# EAGLE design powerboard redux (EAGLE 8.6.1)
COMPANY: ADAFRUIT INDUSTRIES; DRAWN: KTOWN; REV: A
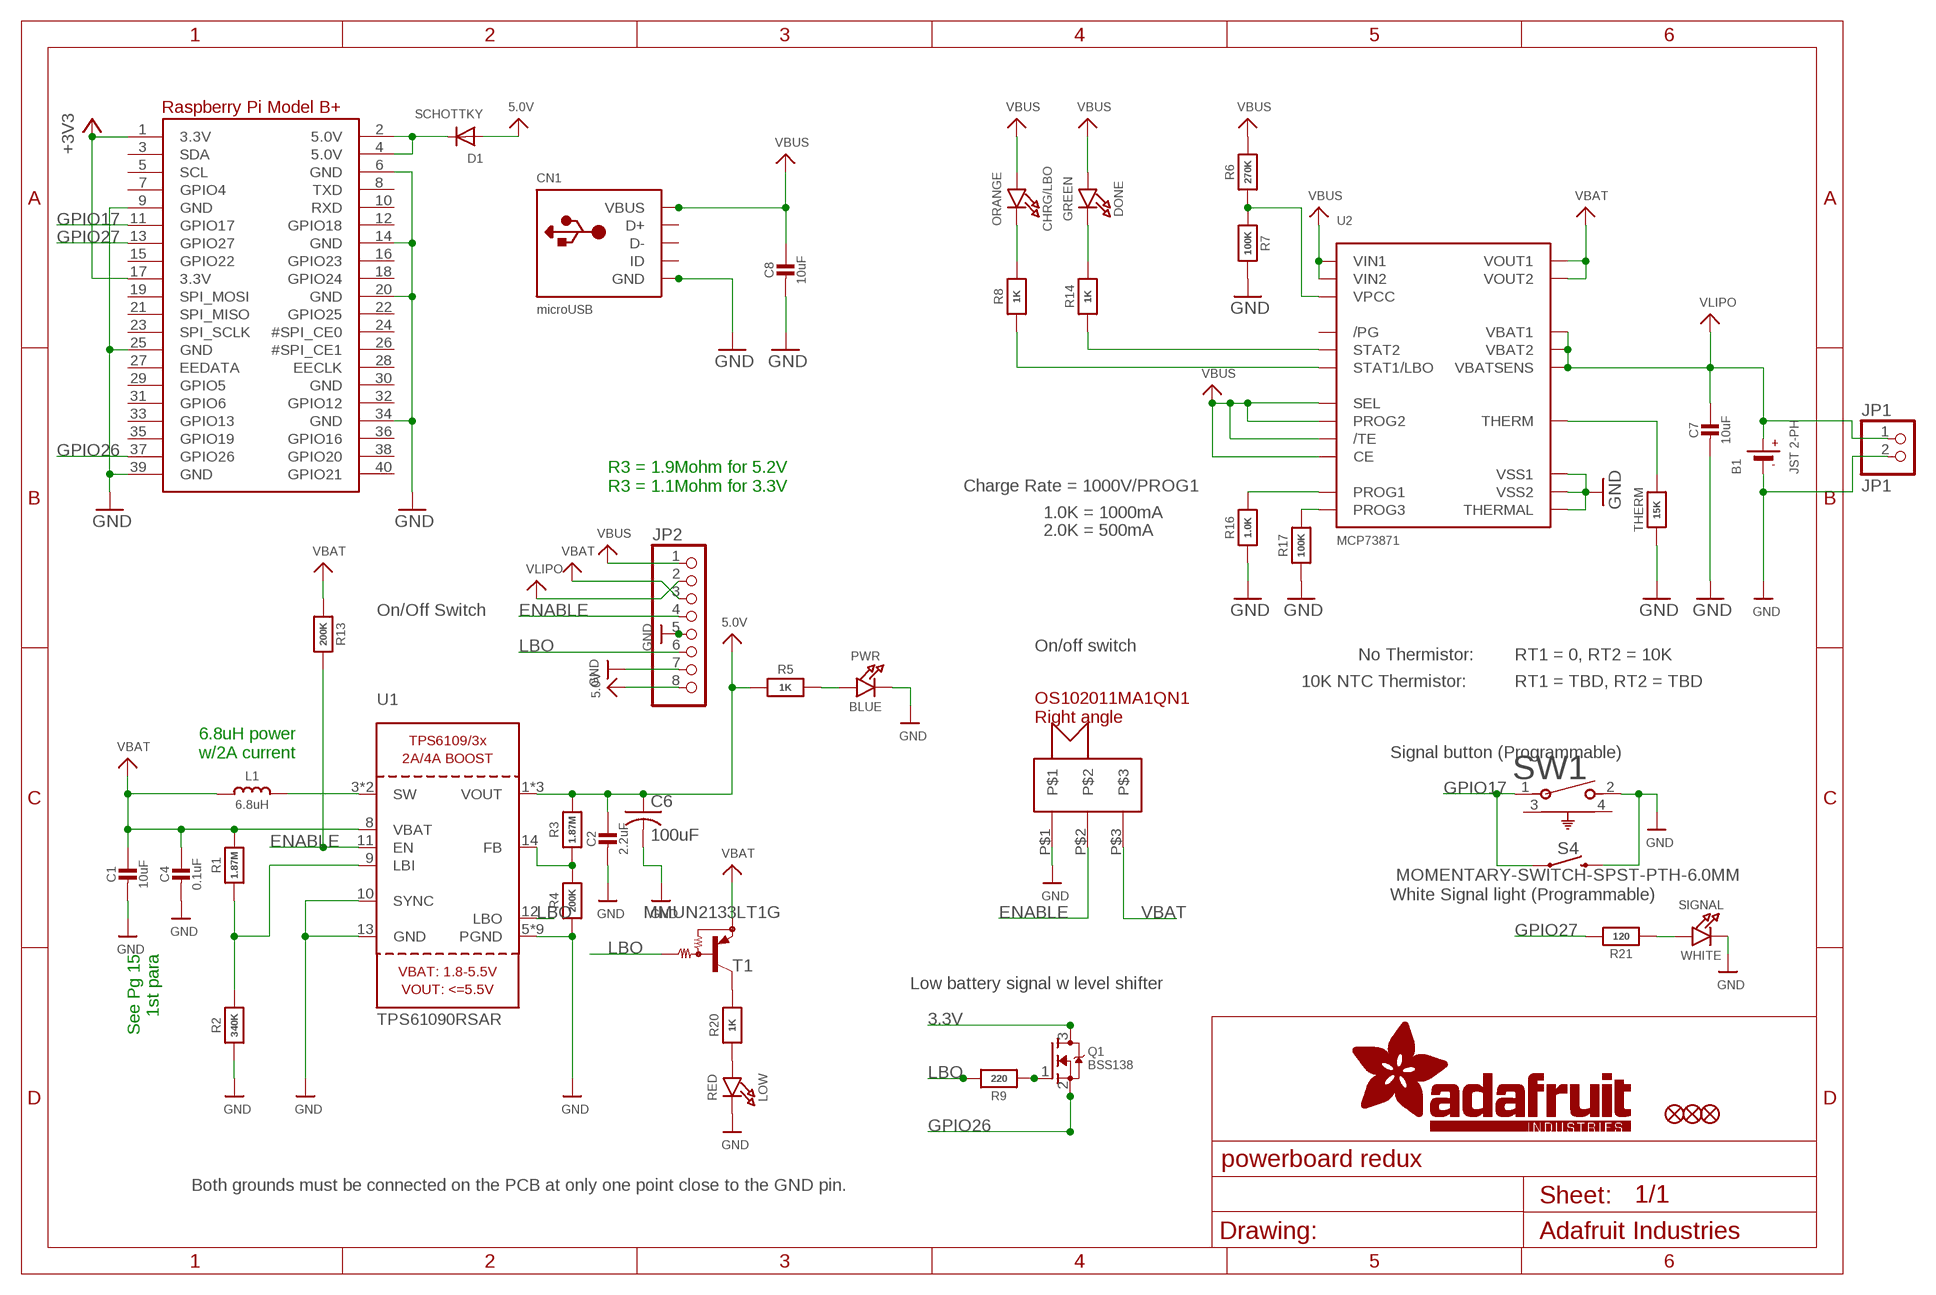
[diagram p0: schematic, sheet 1]

## Parts
B1  JST 2-PH  BATTERY  [JSTPH2]
C1  10uF  CAP_CERAMIC0805-NOOUTLINE  [0805-NO@1]
C2  2.2uF  CAP_CERAMIC0805-NOOUTLINE  [0805-NO@1]
C4  0.1uF  CAP_CERAMIC0805_10MGAP  [0805_10MGAP]
C6  100uF  C-USC1210  [C1210]
C7  10uF  CAP_CERAMIC0805-NOOUTLINE  [0805-NO@1]
C8  10uF  CAP_CERAMIC0805-NOOUTLINE  [0805-NO@1]
CHRG/LBO  ORANGE  LED0805_NOOUTLINE  [CHIPLED_0805_NOOUTLINE]
CN1  microUSB  USBMICRO_20329  [4UCONN_20329]
D1  SCHOTTKY  DIODE_SOD-123FL  [SOD-123FL]
DONE  GREEN  LED0805_NOOUTLINE  [CHIPLED_0805_NOOUTLINE]
FID1  FIDUCIAL""  [FIDUCIAL_1MM]
FID2  FIDUCIAL""  [FIDUCIAL_1MM]
FID3  FIDUCIAL""  [FIDUCIAL_1MM]
JP1  JP1  HEADER-1X2ROUND  [1X02_ROUND]
JP2  HEADER-1X8ROUND  [1X08_ROUND]
L1  6.8uH  INDUCTORTDK_VLC5045  [INDUCTOR_5X5MM_TDK_VLC5045]
LOW  RED  LED0805_NOOUTLINE  [CHIPLED_0805_NOOUTLINE]
PWR  BLUE  LED0805_NOOUTLINE  [CHIPLED_0805_NOOUTLINE]
Q1  BSS138  MOSFET-NREFLOW  [SOT23-R]
R1  1.87M  RESISTOR_0805MP  [_0805MP]
R2  340K  RESISTOR_0805MP  [_0805MP]
R3  1.87M  RESISTOR0805_NOOUTLINE  [0805-NO]
R4  200K  RESISTOR0805_NOOUTLINE  [0805-NO]
R5  1K  RESISTOR0805_NOOUTLINE  [0805-NO]
R6  270K  RESISTOR0805_NOOUTLINE  [0805-NO]
R7  100K  RESISTOR0805_NOOUTLINE  [0805-NO]
R8  1K  RESISTOR0805_NOOUTLINE  [0805-NO]
R9  220  RESISTOR0805_NOOUTLINE  [0805-NO]
R13  200K  RESISTOR0805_NOOUTLINE  [0805-NO]
R14  1K  RESISTOR0805_NOOUTLINE  [0805-NO]
R16  1.0K  RESISTOR0805_NOOUTLINE  [0805-NO]
R17  100K  RESISTOR0805_NOOUTLINE  [0805-NO]
R20  1K  RESISTOR0805_NOOUTLINE  [0805-NO]
R21  120  RESISTOR0805_NOOUTLINE  [0805-NO]
RPI1  RASPBERRYPI_BPLUS_BONNETNODIM  [PI_BONNET_NODIM]
S4  MOMENTARY-SWITCH-SPST-PTH-6.0MM  [TACTILE_SWITCH_PTH_6.0MM]
SIGNAL  WHITE  LED0805_NOOUTLINE  [CHIPLED_0805_NOOUTLINE]
SW1  1825027-5  [SW2_1825027-A]
SW2  OS102011MA1QN1  [OS102011MA1QN1]
T1  MMUN2133LT1G  MUN2114T1-PNP_DRIVER-SC59-BEC  [SC59-BEC]
THERM  15K  RESISTOR0805_NOOUTLINE  [0805-NO]
U1  TPS61090RSAR  VREG_TPS6103X  [PVQFN-16]
U2  MCP73871  [QFN20_4MM]

## Nets
3.3V: Q1.3(D) RPI1.1(3.3V) RPI1.17(3.3V) ; supply symbol labelled +3V3
5.0V: C2.1 C6.1 D1.A JP2.8 R3.2 R5.1 U1.1(VOUT) U1.15(VOUT) U1.16(VOUT)
5.0V@1: D1.C RPI1.2(5.0V) RPI1.4(5.0V)
ENABLE: JP2.4 R13.2 SW2.P$2 U1.11(EN)
GND: B1.1(-) C1.2 C2.2 C4.2 C6.2 C7.2 C8.2 CN1.BASE@1(GND) CN1.BASE@2(GND) CN1.GND CN1.SPRT@1(GND) CN1.SPRT@2(GND) CN1.SPRT@3(GND) CN1.SPRT@4(GND) JP1.2 JP2.5 JP2.7 LOW.C PWR.C R2.1 R4.1 R7.2 R16.1 R17.1 RPI1.6(GND) RPI1.9(GND) RPI1.14(GND) RPI1.20(GND) RPI1.25(GND) RPI1.34(GND) RPI1.39(GND) S4.3 SIGNAL.C SW1.2 SW2.P$1 THERM.1 U1.5(PGND) U1.6(PGND) U1.7(PGND) U1.10(SYNC) U1.13(GND) U1.P$18(PGND) U1.P$19(PGND) U1.P$20(PGND) U1.P$21(PGND) U1.P$22(PGND) U1.THERMAL(PGND) U2.P$10(VSS1) U2.P$11(VSS2) U2.P$21(THERMAL)
GPIO17: RPI1.11(GPIO17) S4.1 SW1.1
GPIO26: Q1.2(S) RPI1.37(GPIO26)
GPIO27: R21.2 RPI1.13(GPIO27)
LBO: JP2.6 R9.2 T1.B U1.12(LBO)
N$1: L1.P$2 U1.3(SW) U1.4(SW)
N$2: LOW.A R20.1
N$3: R1.1 R2.2 U1.9(LBI)
N$4: PWR.A R5.2
N$5: R3.1 R4.2 U1.14(FB)
N$6: R20.2 T1.C
N$7: R6.1 R7.1 U2.P$2(VPCC)
N$8: DONE.C R14.2
N$9: R14.1 U2.P$7(STAT2)
N$10: THERM.2 U2.P$5(THERM)
N$11: R8.1 U2.P$8(STAT1/LBO)
N$12: CHRG/LBO.C R8.2
N$13: R17.2 U2.P$12(PROG3)
N$14: Q1.1(G) R9.1
N$15: R21.1 SIGNAL.A
N$16: R16.2 U2.P$13(PROG1)
VBAT: C1.1 C4.1 JP2.3 L1.P$1 R1.2 R13.1 SW2.P$3 T1.E U1.8(VBAT) U2.P$1(VOUT1) U2.P$20(VOUT2)
VBUS: C8.1 CHRG/LBO.A CN1.VBUS DONE.A JP2.1 R6.2 U2.P$3(SEL) U2.P$4(PROG2) U2.P$9(/TE) U2.P$17(CE) U2.P$18(VIN1) U2.P$19(VIN2)
VLIPO: B1.2(+) C7.1 JP1.1 JP2.2 U2.P$14(VBAT1) U2.P$15(VBAT2) U2.P$16(VBATSENS)
Unconnected: CN1.D+ CN1.D- CN1.ID RPI1.3(SDA) RPI1.5(SCL) RPI1.7(GPIO4) RPI1.8(TXD) RPI1.10(RXD) RPI1.12(GPIO18) RPI1.15(GPIO22) RPI1.16(GPIO23) RPI1.18(GPIO24) RPI1.19(SPI_MOSI) RPI1.21(SPI_MISO) RPI1.22(GPIO25) RPI1.23(SPI_SCLK) RPI1.24(#SPI_CE0) RPI1.26(#SPI_CE1) RPI1.27(EEDATA) RPI1.28(EECLK) RPI1.29(GPIO5) RPI1.31(GPIO6) RPI1.32(GPIO12) RPI1.33(GPIO13) RPI1.35(GPIO19) RPI1.36(GPIO16) RPI1.38(GPIO20) RPI1.40(GPIO21) SW1.3 SW1.4 U2.P$6(/PG)

## Notes on the sheet
- R3 = 1.9Mohm for 5.2V
  R3 = 1.1Mohm for 3.3V
- Charge Rate = 1000V/PROG1
- 1.0K = 1000mA
- 2.0K = 500mA
- On/Off Switch
- On/off switch
- No Thermistor: | RT1 = 0, RT2 = 10K
- 10K NTC Thermistor: | RT1 = TBD, RT2 = TBD
- 6.8uH power
  w/2A current
- Signal button (Programmable)
- White Signal light (Programmable)
- See Pg 15
  1st para
- Low battery signal w level shifter
- Both grounds must be connected on the PCB at only one point close to the GND pin.

## Power pins joined to a net without a drawn wire
GND: RPI1.30(GND)

## Library data of the parts
B1 = microbuilder:BATTERY: CR1220 SMT - Digikey: 3001K-ND CD2032 BAT-HLD-001 - Digikey: BAT-HLD-001-ND
C1 C2 C4 C7 C8 = microbuilder:CAP_CERAMIC: Ceramic Capacitors For new designs, use the packages preceded by an '_' character since they are more reliable: The following footprints should be used on most boards: _0402 - Standard footprint for regular board layouts _0603 - Standard footprint for regular board layouts _0805 - Standard footprint for regular board layouts _1206 - Standard footprint for regular board layouts For extremely tight-pitch boards where space is at a premium, the following 'micro-pitch' footprints can be used (smaller pads, no silkscreen outline, etc.): _0402MP - Micro-pitch footprint for very dense/compact boards _0603MP - Micro-pitch footprint for very dense/compact boards _0805MP - Micro-pitch footprint for very dense/compact boards _1206MP - Micro-pitch footprint for very dense/compact boards
C6 = rcl:C-US: CAPACITOR, American symbol
CHRG/LBO DONE LOW PWR SIGNAL = microbuilder:LED: LED 0603 - 0603 Surface Mount Package 2mA: Green LED - Low Power (3.9mcd, 2ma, 1.7Vf) - Digikey: 475-2709-2-ND Orange LED - Low Power (9.8mcd, 2ma, 1.8Vf) - Digikey: 475-1194-2-ND Red LED - Low Power (5mcd, 2ma, 1.8Vf) - Digikey: 475-1195-2-ND Yellow LED - Low Power (7mcd, 2ma, 1.8Vf) - Digikey: 475-1196-2-ND 5mA: Blue LED - Low Power (17mcd, 5ma, 2.9Vf) - Digikey: LNJ937W8CRACT-ND 0805 - 0805 Surface Mount Package 2mA: Red LED (8.8mcd, 2mA, 1.8Vf, Clear) - Low Power [Digikey: 475-2510-1-ND] Green LED (5mcd, 2mA, 1.8Vf, Clear) - Low Power [Digikey: 475-2730-1-ND] Yellow LED (11.3mcd, 2mA, 1.8Vf, Clear) - Low Power [Digikey: 475-2555-1-ND] 20mA: Red LED (104mcd, 20mA, Diffused) - LS R976 [Digikey: 475-1278-6-ND] Red LED (12mcd, 20mA, 2.0Vf, Clear) - APT2012EC [Digikey: 754-1128-1-ND] Green LED (15mcd, 20mA, 2.2Vf, Clear) - APT2012GC [Digikey: 754-1131-1-ND] Orange LED (160mcd, 20mA, 2.1Vf, Clear) - APT2012SECK [Digikey: 754-1130-1-ND] 1206 - 1206 Surface Mount Package Green LED (26mcd, 20mA, Diffused) - LG N971 [Digikey: 475-1407-6-ND] Red LED (15mcd, 20mA, Diffused) - LH N974 [Digikey: 475-1416-6-ND] Cree - Cree High-Power Surface Mount LEDs XPEBWT-L1-0000-00D50 - White 111lm 350mA 2.9Vf 6200K 110° XTEAWT-00-0000-00000LEE3 - White 114lm 350mA 2.85Vf 5000K 115° Everlight - Everlight 45-21 Series Surface Mount LEDs 45-21/QK2C-B2832AC2CB2/2T - Warm White 2000mcd 20mA 3.25Vf 3050K 120° 45-21/LK2C-B38452C4CB2/2T - Nuetral White 2000mcd 20mA 3.25Vf 4150K 120° 45-21/LK2C-B50634C6CB2/2T - Cold White 2200mcd 20mA 3.25Vf 5650K 120° PLCC2 Reverse Mount LS T77K-J1L2-1-0-2-R18-Z - Red 11.25mcd 2mA 1.8Vf 630nm 120° LO T77K-L1M2-24-Z - Orange 19.6mcd 2mA 1.8Vf 606nm 120° LY T77K-K2M1-26-Z - Yellow 15.7mcd 2mA 1.8Vf 587nm 120°
CN1 = microusb-amphenol-10118194-0001LF:USB: USB Connectors USBMINIB - Surface Mount Female Mini-B USB Connector 4UConnector: 06564
D1 = adafruit:DIODE: Diode SMADIODE - SMA Surface Mount Package 20V 1A Schottky Diode Digikey: 641-1014-6-ND DO-1N4148 - Through Hole Small Current Diode SOD-123 20V 1 A (.5mV Vf) Schottky Diode - Digikey: MBRX120TPMSCT-ND SOD-323 10V 570mA (.38mV Vf, 3ns) Schottky Diode - Digikey: ZLLS410CT-ND SOD-523 30V 30mA Schottky Diode (RB751S-40TE61) - Digikey: RB751S-40TE61CT-ND SOT23-R/W - SOT23 Package (R = Solder Paste/Reflow Ovens, W = Hand-Soldering) BAT54Film 40V 300mA - Digikey: 497-7162-1-ND
FID1-FID3 = microbuilder:FIDUCIAL: Fiducial Alignment Points Various fiducial points for machine vision alignment.; BOM: EXCLUDE
JP1 = microbuilder:HEADER-1X2: PIN HEADER
JP2 = microbuilder:HEADER-1X8: PIN HEADER
L1 = microbuilder:INDUCTOR: Inductors 0603: 10nH Ceramic Inductor - microwire antenna/RF (Digikey: 712-1434-2-ND) 0805: 560nH Ceramic Inductor - RF (Digikey: 553-1047-1-ND) 270nH Ceramic Inductor - Q = 40@250MHz, +-5%, 1 Ohm DC Resistance (Digikey: 535-10506-2-ND) 1007 (2518 Metric) SMT: 10µH 10% 250mOhm 820mA 1007 Inductor (Digikey: 587-2189-1-ND) 22µH 10% 500mOhm 580mA 1007 Inductor (Digikey: 587-2190-1-ND) 47µH 10% 950mOhm 420mA 1007 Inductor (Digikey: 587-2191-1-ND) 47µH 5% 100mOhm 1A 1008 Inductor (Digikey: 732-1816-1-ND) 5.0x5.0mm (Taiyo Yuden NR5040 Series) 6.8µH 20% 2.3A 64mOhm Inductor (Digikey: 587-2374-2-ND) 5.0x5.0mm (TDK VLC5045 Series) 4.7µH 20% 3.3A 34mOhm Inductor (Digikey: 445-6526-1-ND) 6.8µH 20% 2.7A 46mOhm Inductor (Digikey: 445-6527-1-ND) 6.0x6.0mm (TDK VLC6045 Series) 4.7µH 20% 3.8A 27mOhm Inductor (Digikey: 445-6538-2-ND) 6.8µH 20% 3A 41mOhm Inductor (Digikey: 445-6540-1-ND) 6.2µH 30% 2.2A 45mOhm Inductor (Digikey: SRR5028-6R2YCT-ND) - Not TDK VLC6045 but footprint should match 6.0x6.0mm (TDK SLF6045 Series) 6.8uH 30% 2A 33mOhm Inductor (Digikey: 445-4572-1-ND, Mouser: 810-SLF645T6R8N2R0PF) 6.0x6.0mm (Sumida CDRH5D28 Series) 6.2uH 30% 1.8A 45mOhm Inductor (Digikey: 308-1542-1-ND) Taiyo Yuden NR3015T2R2M - 2.2uH 20% 1.5A (Digikey: 587-1648-2-ND, Mouser: 963-NR3015T2R2M) - Used with TI TPS62172 CoilCraft RFID Transponder Coil - MA5532-AE (For use with AS3935 Lightning Sensor) Vishay IHLP 1.0uH Molded Inductor - 24mOhm DCR, 5A, +/-20%, -55°C-125°C (Digikey: 541-1319-1-ND)
Q1 = microbuilder:MOSFET-N: N-Channel Mosfet LEGEND VDS: Voltage Drain-Source ID: Drain Current RDS(ON): Drain-Source On-State Resistance VGS(TH): Gate-Source Threshold Voltage CISS: Drain-Source Input Capacitance SOT-23 Name VDS ID RDS(ON) VGS(TH) CISS Order Number 2N7002E 60V 260mA 2.5 Ohm 2.5V @ 250uA 26.7pF @ 25V 2N7002ET1GOSTR-ND BSH103 30V 850mA 400 mOhm 400mV @ 1mA 83pF @ 24V BSH103,235-ND BSS138 60V 320mA 1.6 Ohm 1.5V @ 250uA 50pF @ 10V Mouser: 771-BSS138PW115 DMN2075U-7 20V 4.2A 38 mOhm 1V @ 250 uA 594.3pF @ 10V DMN2075U-7DICT-ND * BSS138 good choice for I2C level-shifting
R1-R9 R13 R14 R16 R17 R20 R21 THERM = microbuilder:RESISTOR: Resistors For new designs, use the packages preceded by an '_' character since they are more reliable: The following footprints should be used on most boards: _0402 - Standard footprint for regular board layouts _0603 - Standard footprint for regular board layouts _0805 - Standard footprint for regular board layouts _1206 - Standard footprint for regular board layouts For extremely tight-pitch boards where space is at a premium, the following 'micro-pitch' footprints can be used (smaller pads, no silkscreen outline, etc.): _0402MP - Micro-pitch footprint for very dense/compact boards _0603MP - Micro-pitch footprint for very dense/compact boards _0805MP - Micro-pitch footprint for very dense/compact boards _1206MP - Micro-pitch footprint for very dense/compact boards
RPI1 = microbuilder:RASPBERRYPI_BPLUS
S4 = SparkFun-Switches:MOMENTARY-SWITCH-SPST: Momentary Switch (Pushbutton) - SPST Normally-open (NO) SPST momentary switches (buttons, pushbuttons). Variants PTH-12MM - 12mm square, through-hole Momentary Pushbutton Switch - 12mm Square <https://www.sparkfun.com/products/9190> (COM-09190) PTH-6.0MM, PTH-6.0MM-KIT - 6.0mm square, through-hole Mini Pushbutton Switch <https://www.sparkfun.com/products/97> (COM-00097) KIT package intended for soldering kit's - only one side of pads' copper is exposed. PTH-RIGHT-ANGLE-KIT - Right-angle, through-hole Right Angle Tactile Button <https://www.sparkfun.com/products/10791> - Used on SparkFun BigTime Watch Kit <https://www.sparkfun.com/products/11734> SMD-12MM - 12mm square, surface-mount Tactile Button - SMD (12mm) <https://www.sparkfun.com/products/12993> (COM-12993) Used on SparkFun PicoBoard <https://www.sparkfun.com/products/11888> SMD-4.5MM - 4.5mm Square Trackball Switch Used on SparkFun Blackberry Trackballer Breakout <https://www.sparkfun.com/products/13169> SMD-4.6MMX2.8MM - 4.60mm x 2.80mm, surface mount Used on SparkFun SAMD21 Mini Breakout <https://www.sparkfun.com/products/13664> SMD-5.2MM, SMD-5.2-REDUNDANT - 5.2mm square, surface-mount Mini Pushbutton Switch - SMD <https://www.sparkfun.com/products/8720> (COM-08720) Used on Arduino Pro Mini <https://www.sparkfun.com/products/11114> REDUNDANT package connects both switch circuits together SMD-6.0X3.5MM - 6.0 x 3.5mm, surface mount Momentary Reset Switch SMD <https://www.sparkfun.com/products/8229> (COM-08229) SMD-6.2MM-TALL - 6.2mm square, surface mount Tactile Button - SMD (6mm) <https://www.sparkfun.com/products/12992> Used on SparkFun Digital Sandbox <https://www.sparkfun.com/products/12651> SMD-RIGHT-ANGLE - Right-angle, surface mount Used on SparkFun Block for Intel® Edison - Arduino <https://www.sparkfun.com/products/13036>; PROD_ID: SWCH-08441; SF_SKU: COM-00097
SW1 = right angle tactile switch 1825027-5 te connect:1825027-5: Digi-Key part <https://www.digikey.com/product-detail/en/te-connectivity-alcoswitch-switches/1825027-5/450-1662-ND/529484>; MANUFACTURER_PART_NUMBER: 18250275; VENDOR: TE Connectivity
SW2 = rightangleslideswitchspdt:OS102011MA1QN1: OS102011MA1QN1 right angle SPDT slide switch from C&K Vendor Specs <https://www.ckswitches.com/media/1428/os.pdf> Digikey part <https://www.digikey.com/product-detail/en/c-k/OS102011MA1QN1/CKN9559-ND/1981430>
T1 = transistor:*-PNP_DRIVER-: PNP Bias Resistor Transistor
U1 = microbuilder:VREG_TPS6103X: TPS6103x 4A Boost - 1.8-5.5V Input, Adjustable Output to 5.5V
U2 = microbuilder:MCP73871: MCP73871 Lithium Polymer Battery Charger Digikey: MCP73871-2CCI/ML-ND

## Board
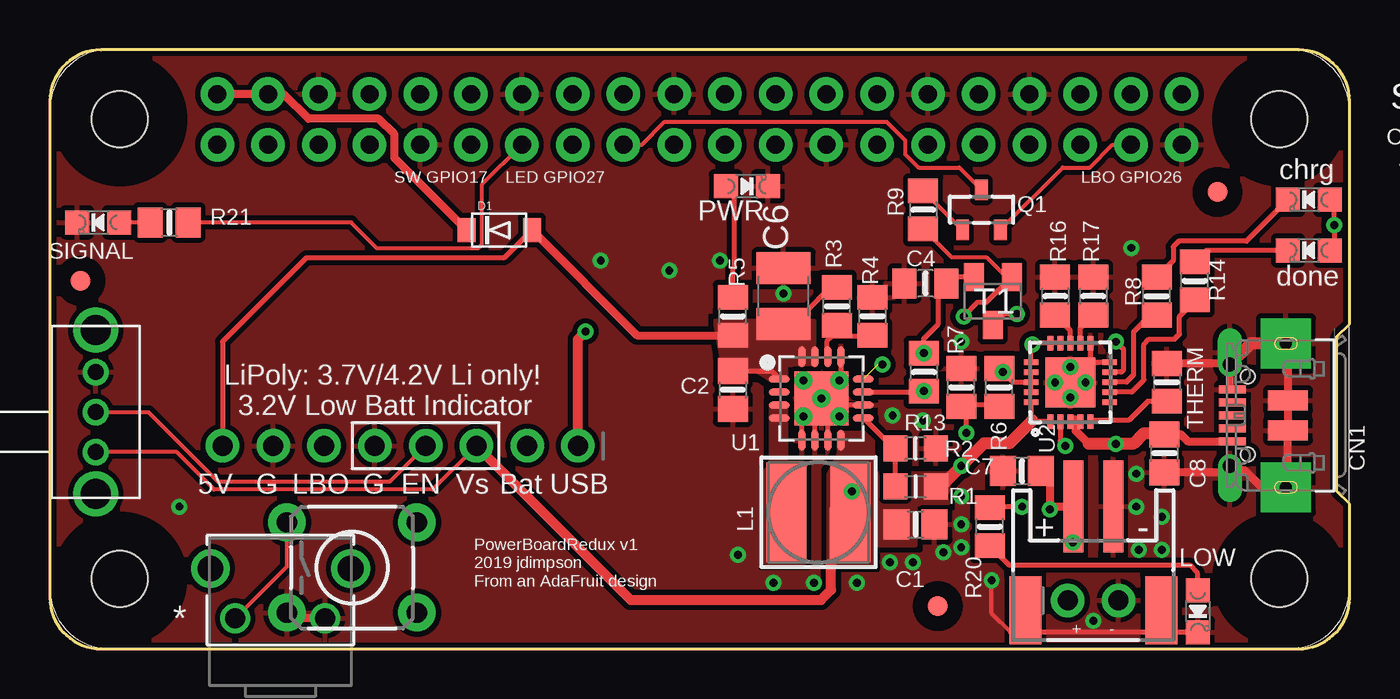
[diagram p1: board, top side]
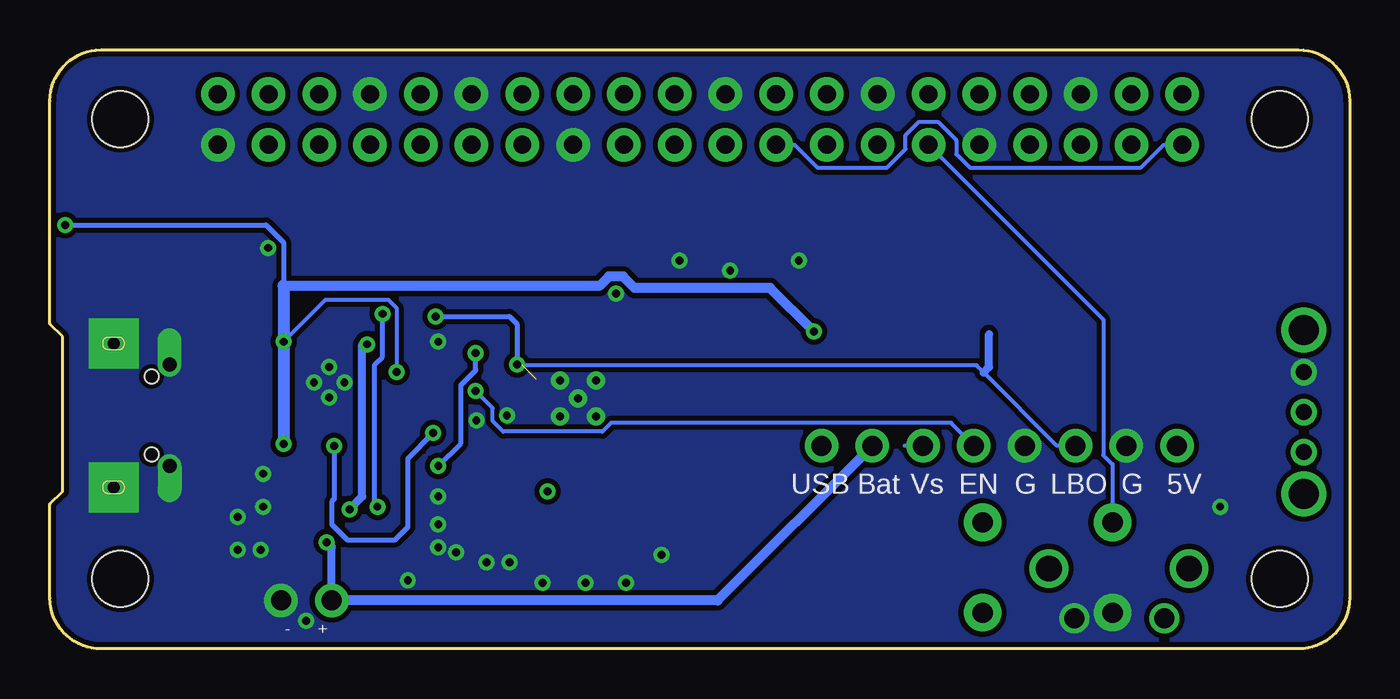
[diagram p2: board, bottom side, seen from below]

Size 65.02 x 29.97 mm. Coordinates in mm from the lower left corner, seen from the top.
Outline: 0,27.43 0,2.54 arc90 2.54,0 62.48,0 arc90 65.02,2.54 65.02,7.24 64.39,7.87 64.39,15.62 65.02,16.26 65.02,27.43 arc90 62.48,29.97 2.54,29.97 arc90 0,27.43
Copper layers (1*16): Top 0.035mm / dielectric 1.5mm / Bottom 0.035mm
Design rules "adafruit *": minimum track width 8mil, minimum drill 15.5mil, track to track 8mil, track to pad 8mil, pad to pad 8mil, via to via 8mil, smd to smd 8mil, copper to edge 10mil, drill to drill 8mil, minimum pad ring 10mil, minimum via ring 8mil, stop-mask expansion 2mil, vias tented up to drill 20mil, thermal gap 10mil
tRestrict: area 39.8,14.4 to 39.9,14.8; area 37.8,10.3 to 38,10.7; area 38.5,10.3 to 38.6,10.7

### Footprints (pad centres in the part's own frame; a part is rotated, then mirrored left to right if it is on the bottom)
JSTPH2 = smd 1 x 4.6: 1 -1,-3.7; 2 1,-3.7 | smd 1.6 x 3.4: NC1 -3.4,1.5; NC2 3.4,1.5
0805-NO@1 = smd 1.3 x 1.5: 1 -0.95,0; 2 0.95,0
0805_10MGAP = smd 1.2 x 1.5: 1 -1.05,0; 2 1.05,0
C1210 = smd 1.6 x 2.7: 1 -1.4,0; 2 1.4,0
CHIPLED_0805_NOOUTLINE = smd 1.2 x 1.2: A 0,-1.05; C 0,1.05
4UCONN_20329 = smd 1 x 2: BASE@1 -0.75,-2; BASE@2 0.75,-2 | smd 0.4 x 1.35: D+ 0,0.775; D- -0.65,0.775; GND 1.3,0.775; ID 0.65,0.775; VBUS -1.3,0.775 | drill 0.7 offset: SPRT@1 -2.538,0.9; SPRT@2 2.538,0.9 | drill 0.6 pad 2.5 square: SPRT@3 -3.6,-1.9; SPRT@4 3.6,-1.9 | hole 0.7: -1.95,0; 1.95,0
SOD-123FL = smd 0.91 x 1.22: A 1.637,0; C -1.637,0
FIDUCIAL_1MM = smd 1 x 1: 1 0,0
1X02_ROUND = drill 1 pad 1.676: 1 -1.27,0; 2 1.27,0
1X08_ROUND = drill 1 pad 1.676: 1 -8.89,0; 2 -6.35,0; 3 -3.81,0; 4 -1.27,0; 5 1.27,0; 6 3.81,0; 7 6.35,0; 8 8.89,0
INDUCTOR_5X5MM_TDK_VLC5045 = smd 2 x 5: P$1 -1.6,0; P$2 1.6,0
SOT23-R = smd 0.635 x 1.016: 1 -0.95,-1; 2 0.95,-1; 3 0,1
_0805MP = smd 1.2 x 1.3: 1 -1.016,0; 2 1.016,0
0805-NO = smd 1.24 x 1.5: 1 -0.95,0; 2 0.95,0
PI_BONNET_NODIM = drill 0.9 pad 1.676: 1 8.37,25.23; 2 8.37,27.77; 3 10.91,25.23; 4 10.91,27.77; 5 13.45,25.23; 6 13.45,27.77; 7 15.99,25.23; 8 15.99,27.77; 9 18.53,25.23; 10 18.53,27.77; 11 21.07,25.23; 12 21.07,27.77; 13 23.61,25.23; 14 23.61,27.77; 15 26.15,25.23; 16 26.15,27.77; 17 28.69,25.23; 18 28.69,27.77; 19 31.23,25.23; 20 31.23,27.77; 21 33.77,25.23; 22 33.77,27.77; 23 36.31,25.23; 24 36.31,27.77; 25 38.85,25.23; 26 38.85,27.77; 27 41.39,25.23; 28 41.39,27.77; 29 43.93,25.23; 30 43.93,27.77; 31 46.47,25.23; 32 46.47,27.77; 33 49.01,25.23; 34 49.01,27.77; 35 51.55,25.23; 36 51.55,27.77; 37 54.09,25.23; 38 54.09,27.77; 39 56.63,25.23; 40 56.63,27.77 | hole 2.8: 3.5,3.5; 3.5,26.5; 61.5,26.5; 61.5,3.5
TACTILE_SWITCH_PTH_6.0MM = drill 1.016 pad 1.88: 1 -3.251,2.261; 2 3.251,2.261; 3 -3.251,-2.261; 4 3.251,-2.261
SW2_1825027-A = drill 0.991 pad 1.499: 1 0,0; 2 4.496,0 | drill 1.295 pad 1.803: 3 -1.245,2.489; 4 5.766,2.489
OS102011MA1QN1 = drill 0.8: P$1 0,0; P$2 2,0; P$3 4,0 | drill 1.5: P$4 -2.1,0; P$5 6.1,0
SC59-BEC = smd 1 x 1.4: B -0.95,-1.2; C 0,1.2; E 0.95,-1.2
PVQFN-16 = smd 1.05 x 0.35: 1 -2.1,0.975; 2 -2.1,0.325; 3 -2.1,-0.325; 4 -2.1,-0.975; 9 2.1,-0.975; 10 2.1,-0.325; 11 2.1,0.325; 12 2.1,0.975 | smd 0.35 x 1.05: 5 -0.975,-2.1; 6 -0.325,-2.1; 7 0.325,-2.1; 8 0.975,-2.1; 13 0.975,2.1; 14 0.325,2.1; 15 -0.325,2.1; 16 -0.975,2.1 | drill 0.4: P$18 0,0; P$19 -0.9,0.9; P$20 0.9,0.9; P$21 0.9,-0.9; P$22 -0.9,-0.9 | smd 2.7 x 2.7: THERMAL 0,0
QFN20_4MM = smd 0.73 x 0.28: P$1 -1.965,1; P$2 -1.965,0.5; P$3 -1.965,0; P$4 -1.965,-0.5; P$5 -1.965,-1; P$11 1.965,-1; P$12 1.965,-0.5; P$13 1.965,0; P$14 1.965,0.5; P$15 1.965,1 | smd 0.28 x 0.73: P$6 -1,-1.965; P$7 -0.5,-1.965; P$8 0,-1.965; P$9 0.5,-1.965; P$10 1,-1.965; P$16 1,1.965; P$17 0.5,1.965; P$18 0,1.965; P$19 -0.5,1.965; P$20 -1,1.965 | smd 2.5 x 2.5: P$21 0,0

### Placement (x,y rotation side)
B1  52.2,3.43 180 top
C1  43.31,6.22 0 top
C2  34.16,12.95 270 top
C4  43.81,18.29 180 top
C6  36.7,17.65 90 top
C7  48.64,8.89 180 top
C8  55.75,9.78 270 top
CHRG/LBO  62.99,22.48 90 top
CN1  59.94,11.68 90 top
D1  22.48,20.96 0 top
DONE  62.99,19.94 90 top
FID1  1.52,18.41 180 top
FID2  44.43,2.14 270 top
FID3  58.42,22.86 180 top
JP1  52.2,2.41 0 top
JP2  17.53,10.16 180 top
L1  38.46,6.83 180 top
LOW  57.44,1.87 180 top
PWR  34.87,23.15 270 top
Q1  46.61,21.97 0 top
R1  43.31,8.13 0 top
R2  43.31,10.03 180 top
R3  39.37,17.14 90 top
R4  41.15,16.64 270 top
R5  34.16,16.64 90 top
R6  47.5,13.08 90 top
R7  45.59,13.08 90 top
R8  55.37,17.65 90 top
R9  43.69,21.97 270 top
R13  43.72,13.84 270 top
R14  57.28,18.41 90 top
R16  50.29,17.65 270 top
R17  52.2,17.65 270 top
R20  47.02,6.11 90 top
R21  5.97,21.34 0 top
RPI1  0,0 0 top
S4  15.11,4.06 0 top
SIGNAL  2.41,21.34 90 top
SW1  9.27,1.52 0 top
SW2  2.29,13.84 270 top
T1  47.17,17.4 180 top
THERM  55.88,13.34 270 top
U1  38.59,12.53 0 top
U2  51.05,13.34 90 top

### Tracks (layer width: path | path; a pad name or v marks a point on that pad's centre or on a via)
3.3V
  Top 0.203: RPI1.17 29.61,25.23 30.76,26.37 41.86,26.37 42.79,25.45 42.79,24.76 43.46,24.09 45.49,24.09 Q1.3
  Bottom 0.203: RPI1.17 27.77,25.23 26.62,24.09 23.14,24.09 22.21,25.01 22.21,25.7 21.54,26.37 20.6,26.37 19.67,25.45 19.67,24.76 19,24.09 10.44,24.09 9.29,25.23 RPI1.1
5.0V
  Top 0.254: R3.2 39.05,18.09 37.85,16.89 37.34,16.89 C6.1 | C2.1 36.09,13.9 U1.1 | D1.A 22.72,19.56 12.83,19.56 8.64,15.37 JP2.8
  Top 0.406: D1.A 29.38,15.69 R5.1
  pour Top (isolate 0.254, no thermals): 38.23,14.22 38.23,16.38 33.27,16.38 33.66,14.35 34.67,14.35 36.07,13.46 36.83,13.46 36.83,14.22
5.0V@1
  Top 0.406: D1.C 17.23,24.56 17.23,25.75 16.46,26.53 12.93,26.53 11.69,27.77 RPI1.4 RPI1.2
ENABLE  (via drill 0.4)
  Top 0.203: SW2.P$2 4.92,11.84 8.38,8.38 17.02,8.38 JP2.4
  Top 0.254: U1.11 43.68,12.85 R13.2
  Bottom 0.203: JP2.4 19.94,11.3 36.95,11.3 37.38,10.87 42.34,10.87 42.87,11.39 42.87,12.04 R13.2
  other vias: 43.72,12.89
GND  (via drill 0.39)
  Top 0.203: 48.07,0.82 47.12,1.78 v47.12,3.43
  Top 0.254: U1.13 39.57,13.66 39.37,13.46 39.46,13.46 U1.P$20 | U1.10 39.25,12.2 39.24,12.19 39.49,11.94 U1.P$21 39.42,11.56 38.99,11.56 38.92,11.49 U1.7 | U1.6 38.27,11.77 38.1,11.94 | U1.5 37.62,11.55 U1.P$22 | LOW.C 48.07,0.82 | U2.P$11 52.05,13.57 v51.82,13.34 | U2.P$10 51.29,14.34 v51.05,14.1
  Top 0.406: CN1.GND 59.04,13.11 CN1.SPRT@2 58.98,14.29 THERM.1 | CN1.SPRT@4 61.94,15.18 CN1.BASE@2 CN1.BASE@1 61.94,8.18 CN1.SPRT@3 60.62,8.08 59.78,8.93 59.61,8.93 59.39,9.15 CN1.SPRT@1 58.73,8.83 C8.2 | SW1.2 12.14,1.52 S4.3
  Top 0.61: CN1.SPRT@4 60.11,15.28 CN1.SPRT@2
  other vias: 34.42,4.7 36.7,17.78 33.53,19.43 30.99,18.92 27.56,19.43 43.69,11.43 45.59,15.37 51.05,12.57 54.1,20.07 42.16,11.68 50.29,13.34 45.59,7.62 43.18,4.32 42.04,4.32 45.59,6.22 44.7,4.83 45.59,5.08 54.36,7.11 54.36,8.76 54.48,4.95 55.63,4.95 55.63,6.6 36.2,3.3 38.23,3.3 40.39,3.3 6.48,7.11 52.2,1.4
  pour Top (isolate 0.254, rank 2): 64.9,29.97 65.28,0.13 0.13,0 -0.25,29.85
  pour Bottom (isolate 0.254, no thermals): 64.9,0 0,0.13 0,30.1 64.9,29.97
GPIO17
  Top 0.203: SW1.1 11.86,4.12 S4.1
  Bottom 0.203: S4.1 11.86,9.23 12.32,9.69 12.32,16.48 RPI1.11
GPIO26
  Top 0.203: Q1.2 50.68,24.09 52.02,24.09 53.17,25.23 RPI1.37
GPIO27
  Top 0.203: R21.2 15.08,21.34 16.38,20.04 21.42,20.04 21.6,20.22 21.6,23.22 RPI1.13
LBO  (via drill 0.39)  (1 unrouted)
  Top 0.203: T1.B 47.85,18.6 46.84,19.6 45.11,19.6 R9.2
  Top 0.254: 41.42,14.22 v41.66,14.22 | v45.72,16.64 46.43,17.34 46.86,17.34 T1.B
  Bottom 0.203: JP2.6 14.64,10.16 18.3,13.83 18.67,14.19 41.62,14.19 v41.66,14.22
  Bottom 0.254: v45.72,16.64 42.04,16.64 41.66,16.26 v41.66,14.22
  Bottom 0.406: 18.3,13.83 18.03,14.1 18.03,15.75
N$1
  pour Top (isolate 0.254, no thermals): 36.83,12.19 36.07,12.19 36.07,9.27 35.81,8.89 35.81,4.32 37.72,4.32 37.72,9.27 36.83,9.27
N$2
  Top 0.254: R20.1 47.99,4.19 57.02,4.19 57.4,3.81 57.4,2.95 LOW.A
N$3
  Top 0.254: R1.1 R2.2 41.93,10.4 41.85,10.4 U1.9
N$4
  Top 0.254: 33.78,17.59 R5.2 34.16,19.03 34.26,19.13 34.26,22.7 PWR.A
N$5
  Top 0.254: 39.12,15.62 38.86,15.37 38.86,14.68 U1.14 | R4.2 41.15,15.62 39.12,15.62 | R3.1 39.37,15.88 39.12,15.62
N$6  (via drill 0.39)
  Top 0.254: v48.39,16.76 47.73,16.76 T1.C | v48.64,7.11 47.07,7.11 R20.2
  Bottom 0.254: v48.64,7.11 48.77,7.24 48.77,14.22 48.39,14.61 v48.39,16.76
N$7  (via drill 0.39)
  Top 0.254: R6.1 47.43,12.13 47.37,12.19 45.65,12.19 R7.1 | R7.1 45.53,12.19 | U2.P$2 50.55,10.41 v50.8,10.16 | v45.85,10.8 45.85,11.88 R7.1
  Bottom 0.254: v50.8,10.16 50.8,7.49 50.93,7.37 50.93,6.22 50.16,5.46 47.75,5.46 47.12,6.1 47.12,9.52 v45.85,10.8
N$8
  Top 0.254: DONE.C 57.85,19.94 R14.2
N$9
  Top 0.254: R14.1 57.28,17.4 56.52,16.64 56.52,15.75 56.26,15.49 54.99,15.49 54.74,15.24 54.74,13.46 54.12,12.85 53.03,12.85 U2.P$7
N$10
  Top 0.254: THERM.2 54.93,12.39 53.98,11.43 52.05,11.43 U2.P$5
N$11
  Top 0.254: R8.1 55.18,16.51 54.86,16.51 54.23,15.88 54.23,13.72 53.86,13.35 53.03,13.35 U2.P$8
N$12
  Top 0.254: CHRG/LBO.C 59.86,20.4 56.47,20.4 56.2,20.12 56.2,19.43 R8.2
N$13
  Top 0.254: U2.P$12 51.55,16.06 R17.2
N$14
  Top 0.203: R9.1 45.64,20.97 Q1.1
N$15
  Top 0.203: R21.1 SIGNAL.A
N$16
  Top 0.254: U2.P$13 51.05,15.94 R16.2
VBAT  (via drill 0.39, 0.4)
  Top 0.203: L1.P$1 40.13,6.9 v40.13,7.87 | SW2.P$3 6.35,9.84 8.21,7.98 19.15,7.98 JP2.3
  Top 0.254: R13.1 43.72,15.53 44.45,16.26 44.45,17.87 C4.1 45.18,18.6 T1.E | U2.P$1 49.21,11.37 49.15,11.43 49.04,11.54 49.09,11.59 U2.P$20
  Top 0.305: 44.96,18.38 C4.1
  Top 0.508: JP2.3 29.05,2.45 38.58,2.45 39.08,2.95 39.08,4.29 39.24,4.45 39.24,6.98 v40.13,7.87
  Top 0.61: 49.15,11.43 48.01,10.29 46.74,10.29 v45.59,9.14 44.7,8.25 44.32,8.25 R1.2
  Bottom 0.203: JP2.3 22.26,10.16
  Bottom 0.254: R13.1 43.72,13.93 44.45,13.2 44.45,10.28 v45.59,9.14
  other vias: 43.72,14.79
  pour Top (isolate 0.254, no thermals): 39.5,10.8 41.15,10.8 41.15,4.19 38.99,4.19 38.99,8.76 39.5,9.78
  pour Top (no thermals): 43.31,5.21 43.31,7.24 44.96,7.24 44.96,8.76 41.27,8.76 41.15,5.21
VBUS  (via drill 0.39, 0.4)
  Top 0.254: v47.68,13.85 48.18,13.35 49.08,13.35 U2.P$18 | v53.34,15.37 53.72,14.99 53.72,13.97 53.6,13.85 53.03,13.85 U2.P$9 | U2.P$4 U2.P$3 51.22,11.37 51.23,11.38 | U2.P$19 U2.P$18 | U2.P$18 U2.P$17 | CHRG/LBO.A 64.26,22.26 v64.26,21.21 64.26,20.16 DONE.A
  Top 0.406: 51.97,10.26 51.31,10.92 51.31,11.31 | v47.68,13.85 R6.2 | C8.1 56.58,10.73 56.93,10.38 CN1.VBUS
  Top 0.508: JP2.1 26.42,15.49 v26.8,15.88
  Top 0.61: 51.97,10.26 v53.34,10.26 54.2,10.26 54.74,10.8 55.69,10.8 C8.1 | 51.23,11.38 51.31,11.31
  Bottom 0.203: v53.34,15.37 51.24,17.47 48.09,17.47 47.68,17.06 v47.68,13.85
  Bottom 0.254: 53.34,18.16 53.34,20.34 54.21,21.21 v64.26,21.21
  Bottom 0.508: 53.34,18.16 37.53,18.16 37.06,18.64 36.35,18.64 35.78,18.07 28.99,18.07 v26.8,15.88
  Bottom 0.61: v53.34,10.26 v53.34,15.37 53.34,18.16
VLIPO  (via drill 0.39, 0.4)
  Top 0.203: v51.18,5.33 51.18,7.11 B1.2
  Top 0.254: U2.P$14 U2.P$15 49.21,15.3 v49.15,15.24 49.09,15.18 U2.P$16
  Top 0.406: B1.2 50.18,7.13 v50.04,6.98 50.04,8.44 C7.1
  Bottom 0.406: v49.15,15.24 49.4,15.24 49.4,7.62 v50.04,6.98 | JP1.1 50.93,5.08 v51.18,5.33
  Bottom 0.508: JP2.2 31.62,2.41 JP1.1

### Text on the board
tPlace: chrg | SW GPIO17 | LED GPIO27 | LBO GPIO26 | PWR | done | LiPoly: 3.7V/4.2V Li only! | 3.2V Low Batt Indicator | 5V | G | LBO | G | EN | Vs | Bat | USB | + | - | PowerBoardRedux v1 / 2019 jdimpson / From an AdaFruit design | LOW | + -
bPlace: 5V | G | LBO | G | EN | Vs | Bat | USB | - +